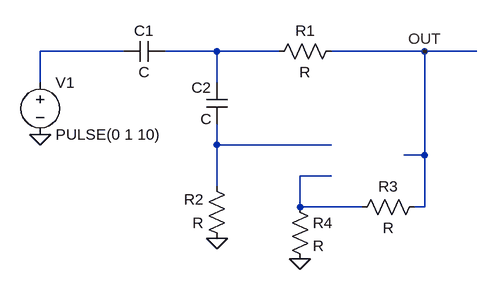
[diagram p0: schematic CIRCUITO_TPposhito.asc]
CIRCUITO_TPposhito.asc, the LTspice schematic file:
Version 4
SHEET 1 880 680
WIRE 0 -16 -128 -16
WIRE 144 -16 64 -16
WIRE 240 -16 144 -16
WIRE 464 -16 320 -16
WIRE 544 -16 464 -16
WIRE -128 32 -128 -16
WIRE 144 32 144 -16
WIRE 144 128 144 96
WIRE 320 128 144 128
WIRE 464 144 464 -16
WIRE 464 144 432 144
WIRE 320 176 272 176
WIRE 144 192 144 128
WIRE 272 224 272 176
WIRE 368 224 272 224
WIRE 464 224 464 144
WIRE 464 224 448 224
FLAG -128 112 0
FLAG 144 272 0
FLAG 272 304 0
FLAG 464 -16 OUT
SYMBOL voltage -128 16 R0
WINDOW 123 0 0 Left 2
WINDOW 39 0 0 Left 2
SYMATTR InstName V1
SYMATTR Value PULSE(0 1 10)
SYMBOL cap 64 -32 R90
WINDOW 0 0 32 VBottom 2
WINDOW 3 32 32 VTop 2
SYMATTR InstName C1
SYMBOL cap 160 96 R180
WINDOW 0 24 56 Left 2
WINDOW 3 24 8 Left 2
SYMATTR InstName C2
SYMBOL res 336 -32 R90
WINDOW 0 0 56 VBottom 2
WINDOW 3 32 56 VTop 2
SYMATTR InstName R1
SYMBOL res 160 288 R180
WINDOW 0 36 76 Left 2
WINDOW 3 36 40 Left 2
SYMATTR InstName R2
SYMBOL res 352 240 R270
WINDOW 0 32 56 VTop 2
WINDOW 3 0 56 VBottom 2
SYMATTR InstName R3
SYMBOL res 256 208 R0
SYMATTR InstName R4

The netlist it stands for:
* CIRCUITO_TPposhito.asc
V1 N001 0 PULSE(0 1 10)
C1 N002 N001 C
C2 N003 N002 C
R1 OUT N002 R
R2 0 N003 R
R3 N004 OUT R
R4 N004 0 R
.backanno
.end